# Altium schematic sheet obc-v2_DEBUG.SchDoc
size 420 x 297 mm; SheetNumber: 11; SheetTotal: 23
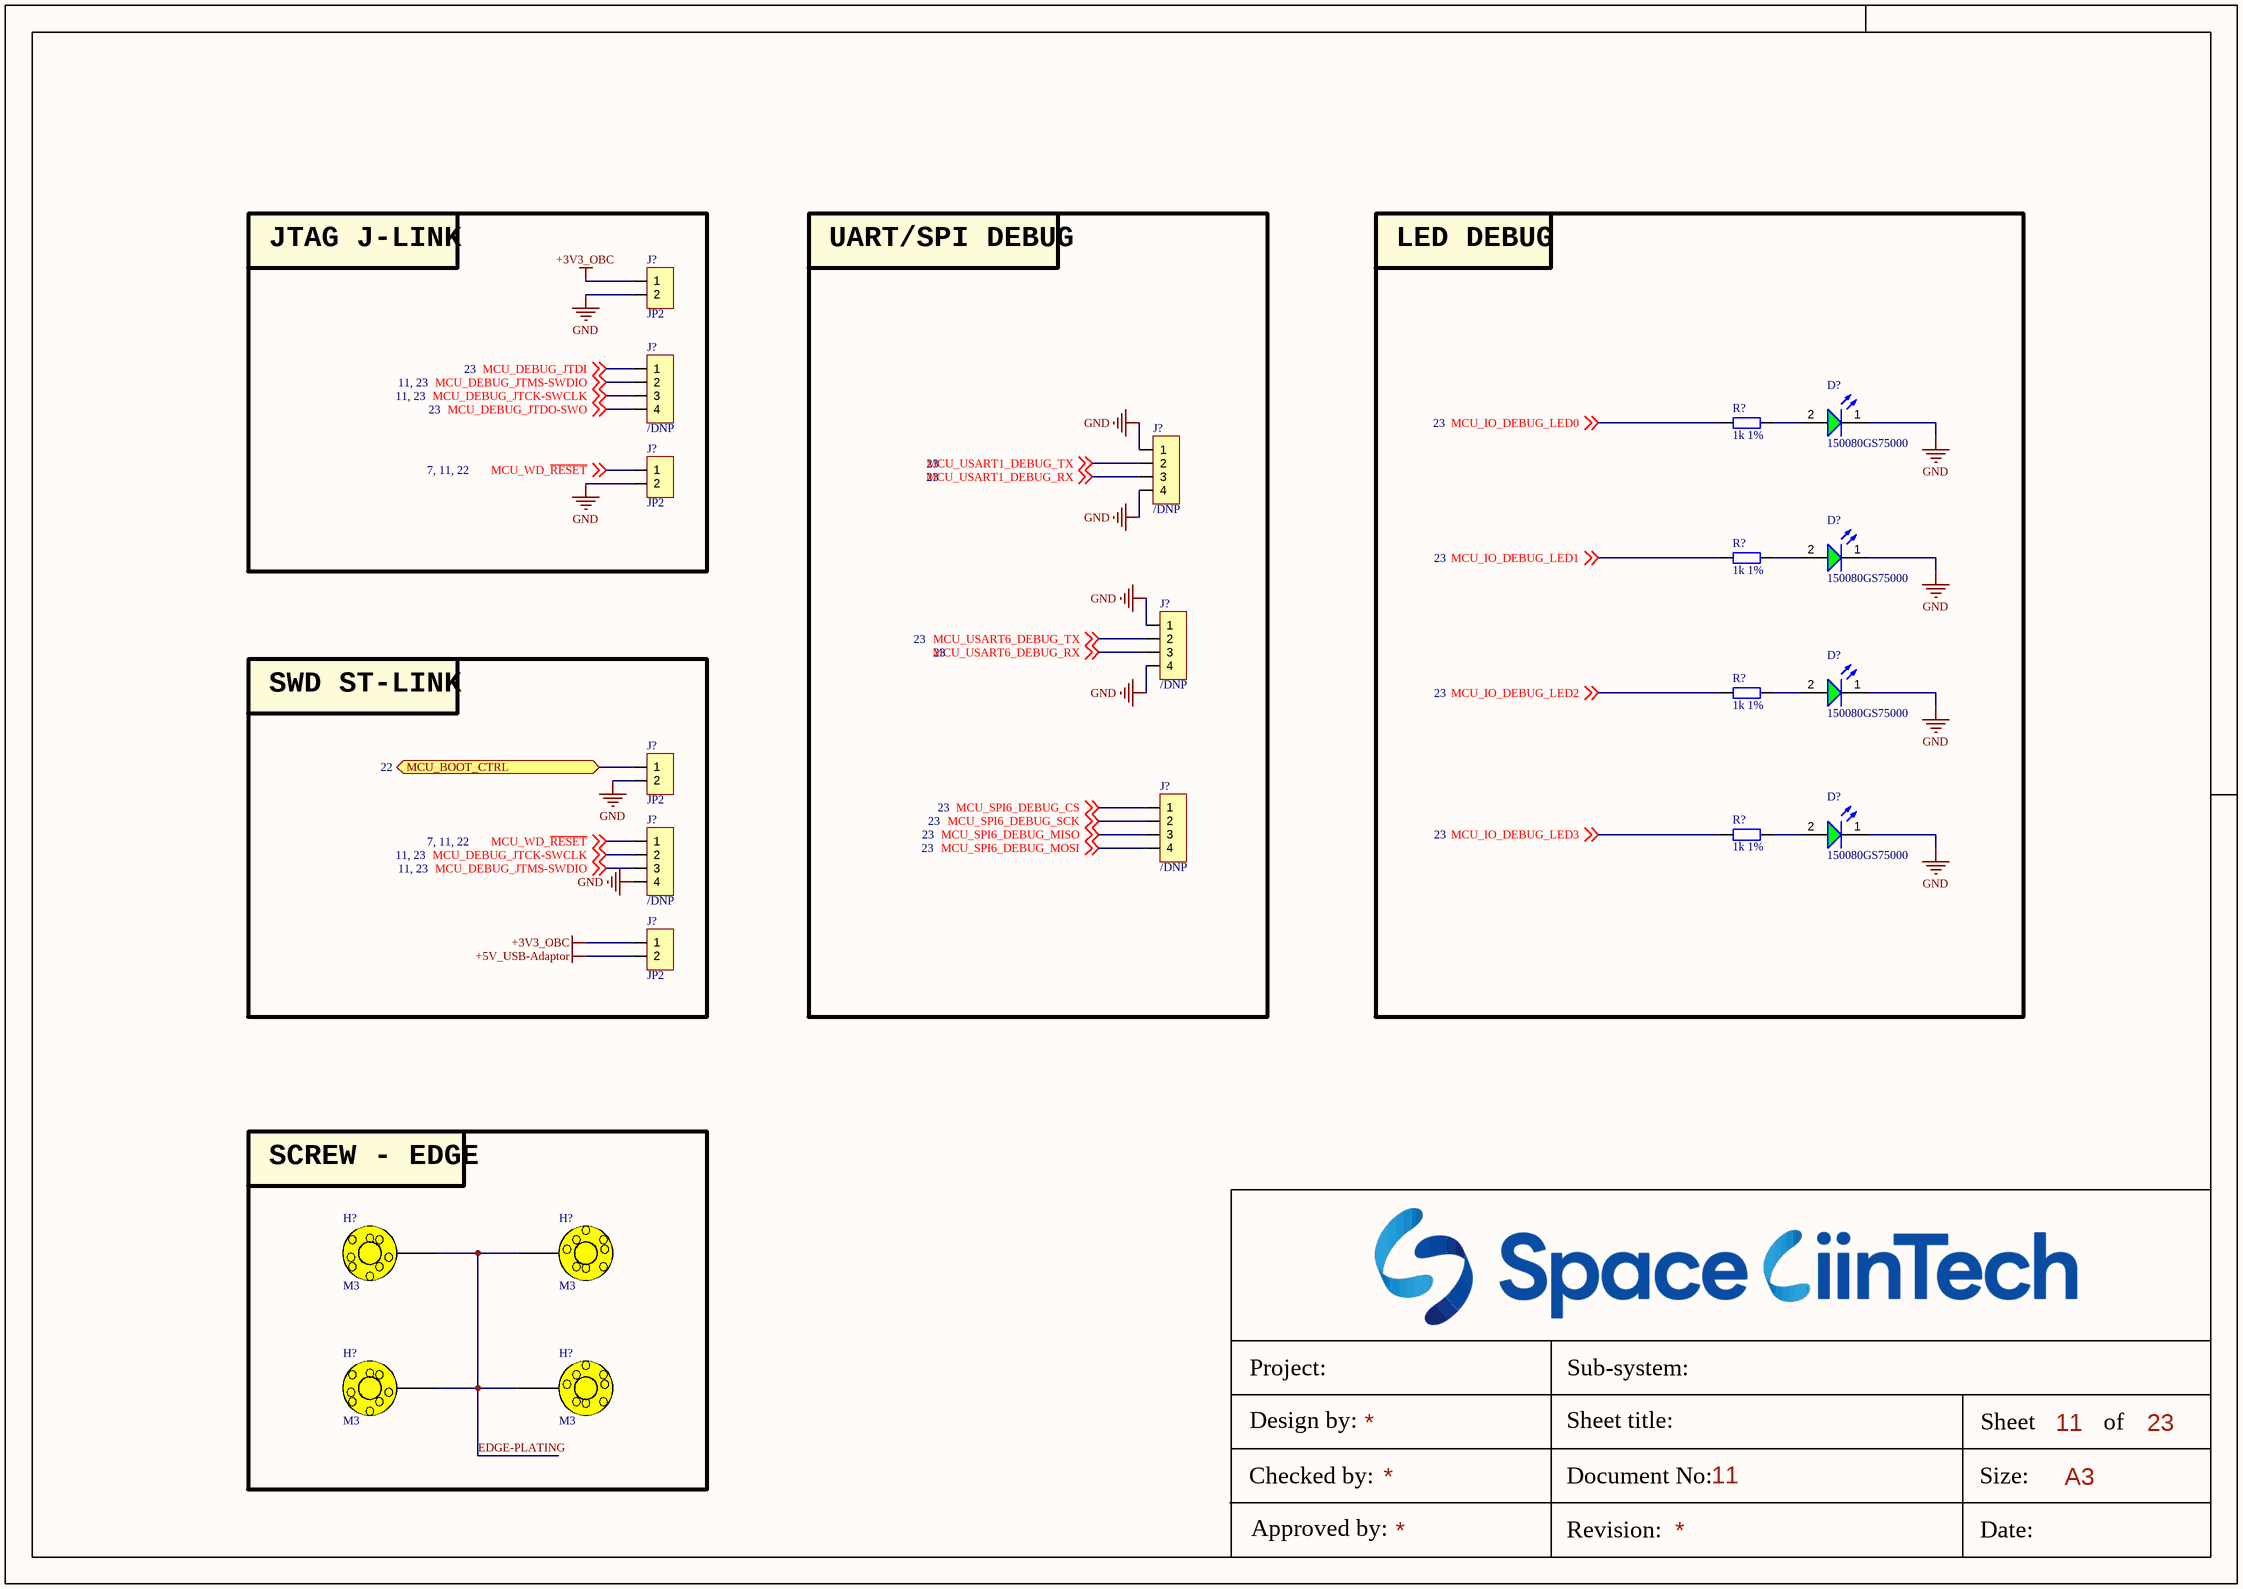
[diagram p0: obc-v2_DEBUG.SchDoc]

## Parts
(Parts that share a designator on the sheet are numbered #1, #2 ... from top to bottom, then left to right.)
D?#1  150080GS75000  [WL-SMCW_0805_150080xx75000]
D?#2  150080GS75000  [WL-SMCW_0805_150080xx75000]
D?#3  150080GS75000  [WL-SMCW_0805_150080xx75000]
D?#4  150080GS75000  [WL-SMCW_0805_150080xx75000]
H?#1  M3  [HEX-M3]
H?#2  M3  [HEX-M3]
H?#3  M3  [HEX-M3]
H?#4  M3  [HEX-M3]
J?#1  JP2  [JP2-D1T]
J?#2  /DNP  [JP4-C1T]
J?#3  /DNP  [JP4-C1T]
J?#4  JP2  [JP2-D1T]
J?#5  /DNP  [JP4-C1T]
J?#6  JP2  [JP2-D1T]
J?#7  /DNP  [JP4-C1T]
J?#8  /DNP  [JP4-C1T]
J?#9  JP2  [JP2-D1T]
R?#1  1k 1%  [tro smd 0603]
R?#2  1k 1%  [tro smd 0603]
R?#3  1k 1%  [tro smd 0603]
R?#4  1k 1%  [tro smd 0603]

## Blocks framed on the sheet
JTAG J-LINK: J?#1 J?#2 J?#4
UART/SPI DEBUG: J?#3 J?#5 J?#7
LED DEBUG: D?#1-D?#4 R?#1-R?#4
SWD ST-LINK: J?#6 J?#8 J?#9
SCREW - EDGE: H?#1-H?#4

## Ports
MCU_BOOT_CTRL (bidir, see 22)

## Nets
+3V3_OBC: J?#1.1 J?#9.1
+5V_USB-Adaptor: J?#9.2
GND: D?#1.1(K) D?#2.1(K) D?#3.1(K) D?#4.1(K) J?#1.2 J?#3.1 J?#3.4 J?#4.2 J?#5.1 J?#5.4 J?#6.2 J?#8.4
EDGE-PLATING: H?#1.1 H?#2.1 H?#3.1 H?#4.1
MCU_BOOT_CTRL: J?#6.1 ; port MCU_BOOT_CTRL
MCU_DEBUG_JTCK-SWCLK: J?#2.3 J?#8.2 ; off-sheet MCU_DEBUG_JTCK-SWCLK
MCU_DEBUG_JTDI: J?#2.1 ; off-sheet MCU_DEBUG_JTDI
MCU_DEBUG_JTDO-SWO: J?#2.4 ; off-sheet MCU_DEBUG_JTDO-SWO
MCU_DEBUG_JTMS-SWDIO: J?#2.2 J?#8.3 ; off-sheet MCU_DEBUG_JTMS-SWDIO
MCU_IO_DEBUG_LED0: R?#1.2 ; off-sheet MCU_IO_DEBUG_LED0
MCU_IO_DEBUG_LED1: R?#2.2 ; off-sheet MCU_IO_DEBUG_LED1
MCU_IO_DEBUG_LED2: R?#3.2 ; off-sheet MCU_IO_DEBUG_LED2
MCU_IO_DEBUG_LED3: R?#4.2 ; off-sheet MCU_IO_DEBUG_LED3
MCU_SPI6_DEBUG_CS: J?#7.1 ; off-sheet MCU_SPI6_DEBUG_CS
MCU_SPI6_DEBUG_MISO: J?#7.3 ; off-sheet MCU_SPI6_DEBUG_MISO
MCU_SPI6_DEBUG_MOSI: J?#7.4 ; off-sheet MCU_SPI6_DEBUG_MOSI
MCU_SPI6_DEBUG_SCK: J?#7.2 ; off-sheet MCU_SPI6_DEBUG_SCK
MCU_USART1_DEBUG_RX: J?#3.3 ; off-sheet MCU_USART1_DEBUG_RX
MCU_USART1_DEBUG_TX: J?#3.2 ; off-sheet MCU_USART1_DEBUG_TX
MCU_USART6_DEBUG_RX: J?#5.3 ; off-sheet MCU_USART6_DEBUG_RX
MCU_USART6_DEBUG_TX: J?#5.2 ; off-sheet MCU_USART6_DEBUG_TX
MCU_WD_~{RESET}: J?#4.1 J?#8.1 ; off-sheet MCU_WD_~{RESET}
NetD?#1_2: D?#1.2(A) R?#1.1
NetD?#2_2: D?#2.2(A) R?#2.1
NetD?#3_2: D?#3.2(A) R?#3.1
NetD?#4_2: D?#4.2(A) R?#4.1

## Notes on the sheet
- Project:
- Sub-system:
- Design by:
- Sheet title:
- Sheet
- A3
- of
- Checked by:
- Approved by:
- Revision:
- Document No:
- Size:
- Date:

## Library data of the parts
D?#1-D?#4 = CMP-1426-00007-2: NexarPartId: 29717780; Wavelength: 520nm; Forward Current: 100mA; Lens Style: Clear, Rectangular; Dominant Wavelength: 525nm; Max Junction Temperature (Tj): 95°C; Power Dissipation: 105mW; Luminous Intensity: 450mcd; Peak Wavelength: 515nm; Color: Green; Viewing Angle: 140°; Test Current: 20mA; Reverse Voltage: 5V; Forward Voltage: 3.2V; Mount: Surface Mount; REACH SVHC: Unknown; Min Operating Temperature: -40°C; Case Code (Imperial): 0805; Case/Package: 0805; Max Operating Temperature: 85°C; RoHS: Compliant; Length: 2mm; Height: 700µm; Width: 1.25mm; Case Code (Metric): 2012; Packaging: Tape and Reel; Max Reverse Voltage (DC): 5V
H?#1-H?#4 = HEX-M3
J?#1 J?#4 J?#6 J?#9 = JP2: WR-PHD 2.54 mm Angled Socket Header; Manufacturer: W¨¹rth Elektronik eiSos GmbH; partNo: 613002143121; ComponentLink1 Description: Manufacturer; ComponentLink2 Description: Datasheet; NoPins: 02; Created Date: 29 March 2013; ComponentLink1URL: http://www.we-online.com; ComponentLink2URL: http://katalog.we-online.de/em/datasheet/6130xx143121.pdf; Created by: Karrer Zheng
J?#2 J?#3 J?#5 J?#7 J?#8 = JP4: WR-PHD 2.54 mm Angled Socket Header; Manufacturer: W¨¹rth Elektronik eiSos GmbH; partNo: 613004143121; ComponentLink1 Description: Manufacturer; ComponentLink2 Description: Datasheet; NoPins: 04; Created Date: 29 March 2013; ComponentLink1URL: http://www.we-online.com; ComponentLink2URL: http://katalog.we-online.de/em/datasheet/6130xx143121.pdf; Created by: Karrer Zheng
R?#1-R?#4 = Tro 0603 1% 10k: RES SMD 1K OHM 1% 1/10W 0603, P/N: ERJ-3EKF1001V; Chung_Loai: Dán; Don_Vi: Con; So_Chan: 2; Ten_Linh_Kien: Trở 0603 1% 10k; Ma_Hang: MH006333; Kieu_Chan: *